# Altium schematic sheet Scrap Schematics - new UVOV protection.SchDoc
size A1
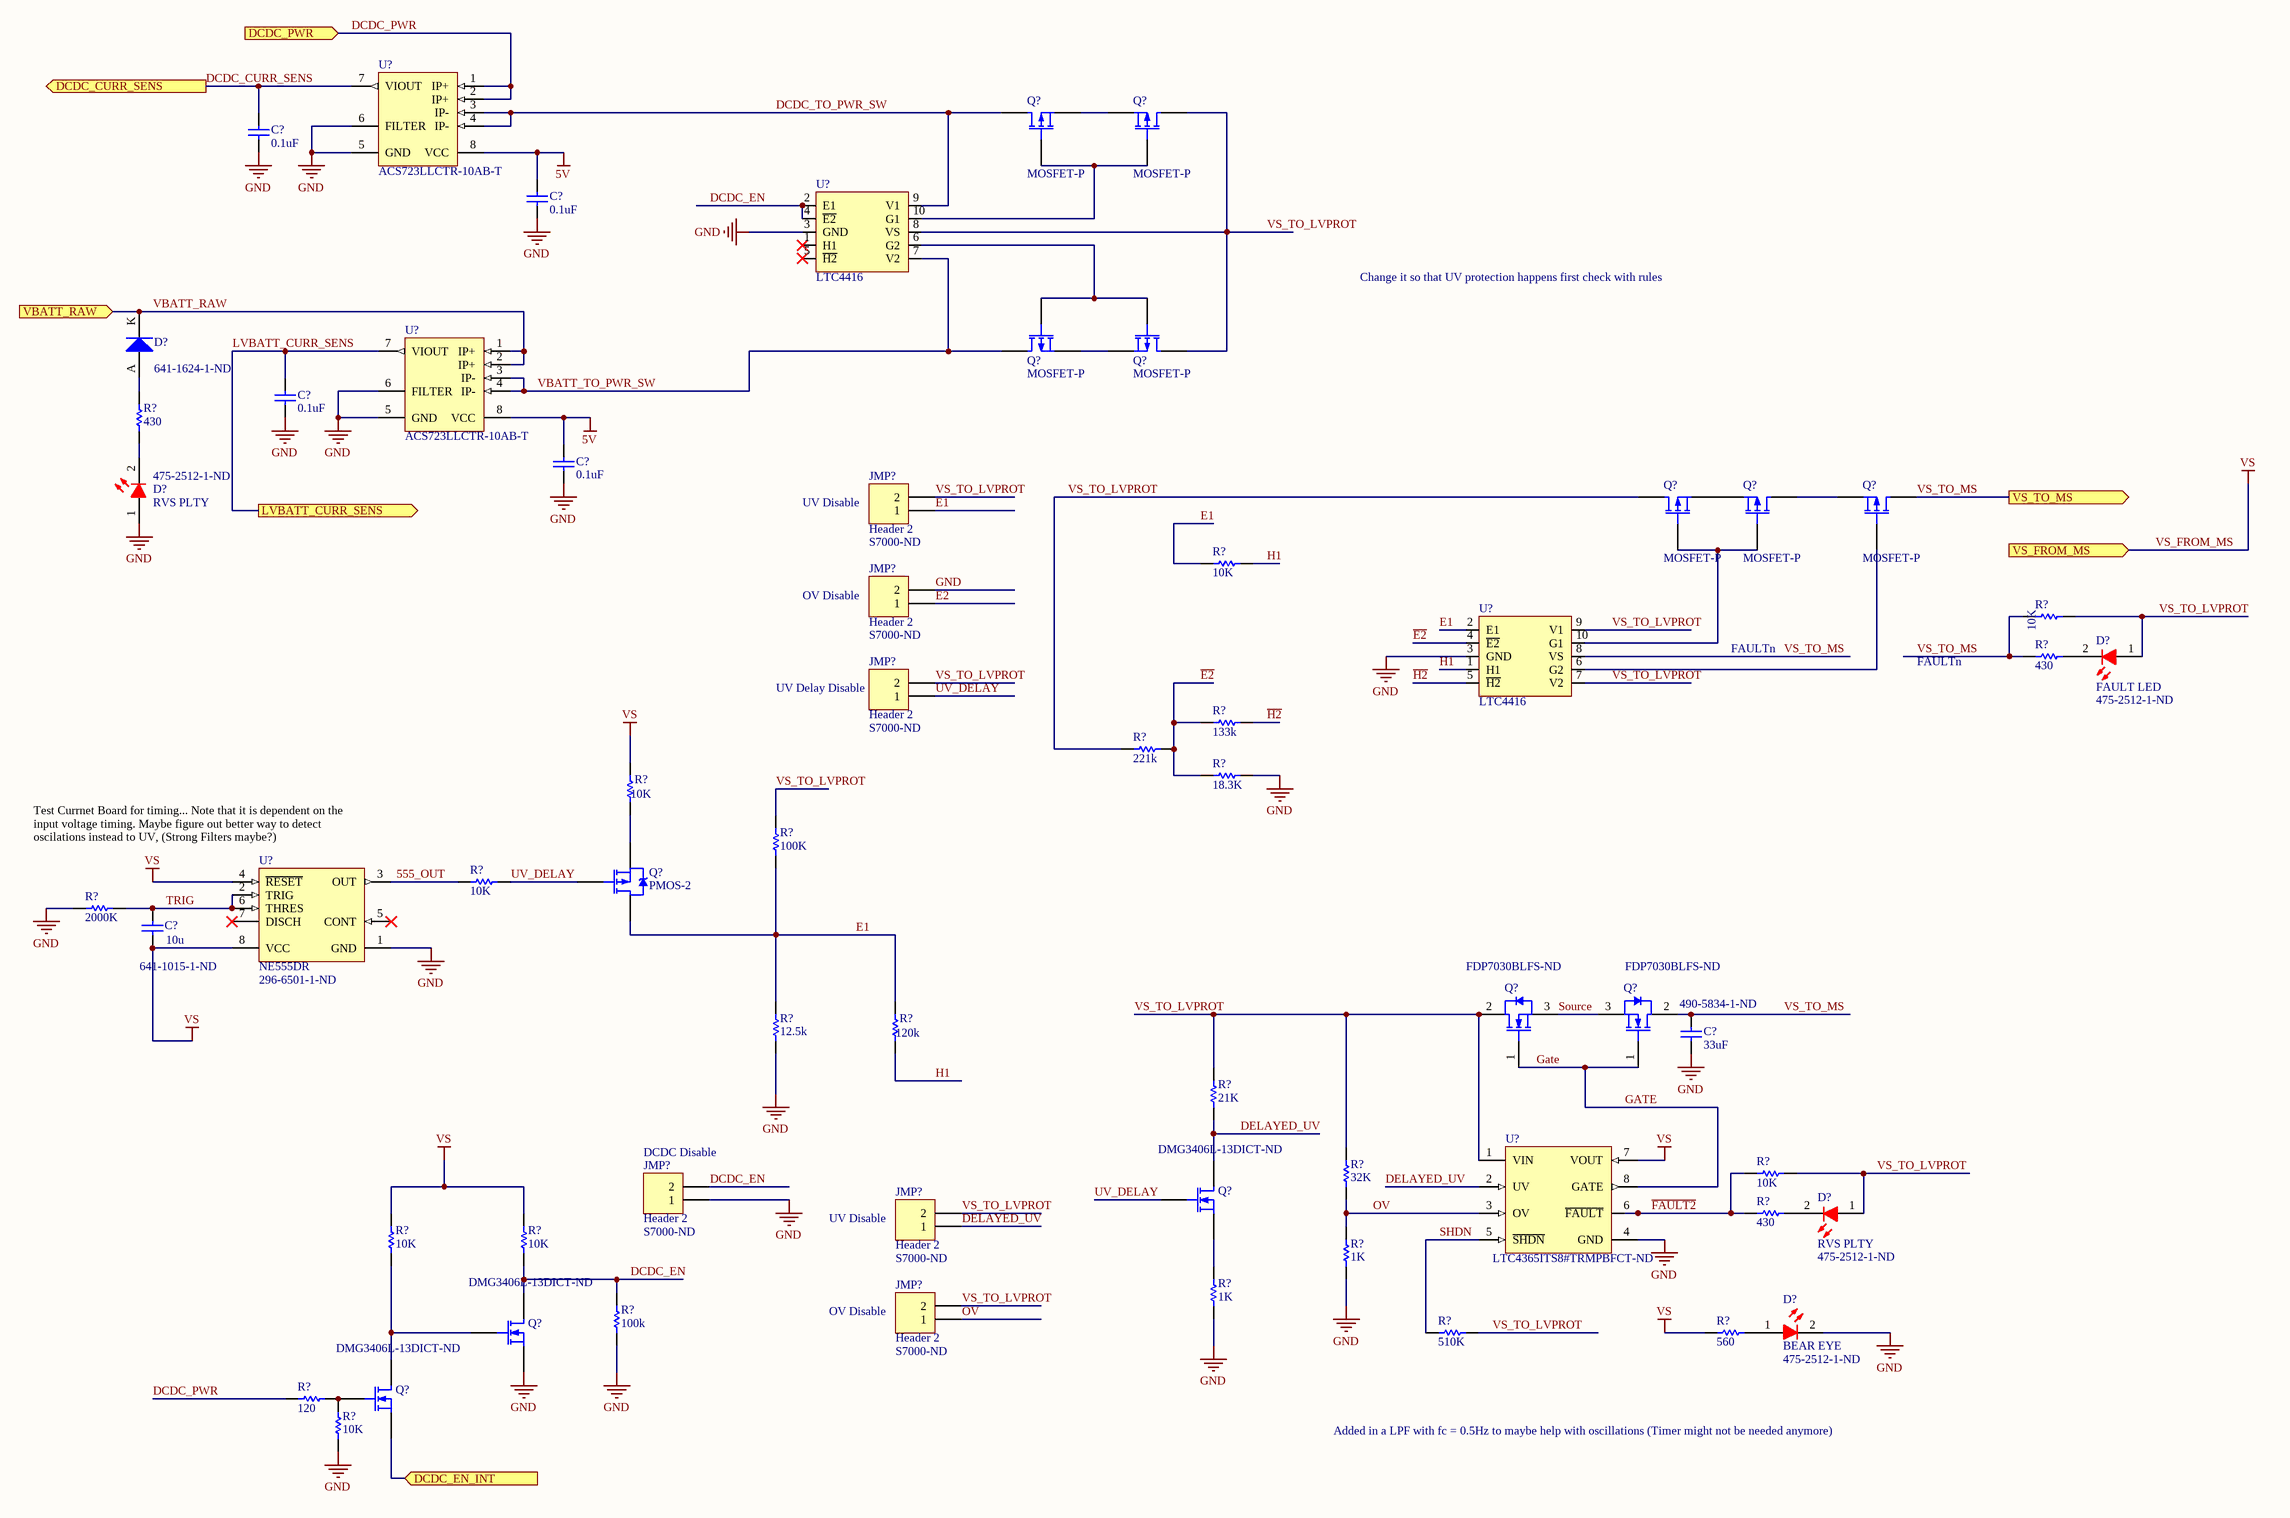
[diagram p0: Scrap Schematics - new UVOV protection.SchDoc]

## Parts
(Parts that share a designator on the sheet are numbered #1, #2 ... from top to bottom, then left to right.)
C?#1  value 0.1uF  [1608[0603]]  (hidden comment: Cap Semi)
C?#2  value 0.1uF  [1608[0603]]  (hidden comment: Cap Semi)
C?#3  value 0.1uF  [1608[0603]]  (hidden comment: Cap Semi)
C?#4  value 0.1uF  [1608[0603]]  (hidden comment: Cap Semi)
C?#5  10u  Supplier Part Number 1: 641-1015-1-ND  [C1210]
C?#6  value 33uF  Supplier Part Number 1: 490-5834-1-ND  [2J-Lead 6.1 x 5.3]  (hidden comment: Cap Semi)
D?#1  Supplier Part Number 1: 641-1624-1-ND  [SOD-123]
D?#2  RVS PLTY  Supplier Part Number 1: 475-2512-1-ND  [TOSH-0603LED_RED_V]
D?#3  FAULT LED  Supplier Part Number 1: 475-2512-1-ND  [TOSH-0603LED_RED_V]
D?#4  RVS PLTY  Supplier Part Number 1: 475-2512-1-ND  [TOSH-0603LED_RED_V]
D?#5  BEAR EYE  Supplier Part Number 1: 475-2512-1-ND  [TOSH-0603LED_RED_V]
JMP?#1  Header 2  Supplier Part Number 1: S7000-ND  [HDR1X2]
JMP?#2  Header 2  Supplier Part Number 1: S7000-ND  [HDR1X2]
JMP?#3  Header 2  Supplier Part Number 1: S7000-ND  [HDR1X2]
JMP?#4  Header 2  Supplier Part Number 1: S7000-ND  [HDR1X2]
JMP?#5  Header 2  Supplier Part Number 1: S7000-ND  [HDR1X2]
JMP?#6  Header 2  Supplier Part Number 1: S7000-ND  [HDR1X2]
Q?#1  MOSFET-P  [P-CH Mosfet]
Q?#2  MOSFET-P  [P-CH Mosfet]
Q?#3  MOSFET-P  [P-CH Mosfet]
Q?#4  MOSFET-P  [P-CH Mosfet]
Q?#5  MOSFET-P  [P-CH Mosfet]
Q?#6  MOSFET-P  [P-CH Mosfet]
Q?#7  MOSFET-P  [P-CH Mosfet]
Q?#8  PMOS-2  [SOT23_M]
Q?#9  Supplier Part Number 1: FDP7030BLFS-ND  [TO220V-GDS]
Q?#10  Supplier Part Number 1: FDP7030BLFS-ND  [TO220V-GDS]
Q?#11  Supplier Part Number 1: DMG3406L-13DICT-ND  [SOT-23_N]
Q?#12  Supplier Part Number 1: DMG3406L-13DICT-ND  [SOT-23_N]
Q?#13  Supplier Part Number 1: DMG3406L-13DICT-ND  [SOT-23_N]
R?#1  430  [RESC0603(1608)_L]
R?#2  10K  [RESC0603(1608)_L]
R?#3  10K  [RESC0603(1608)_L]
R?#4  430  [RESC0603(1608)_L]
R?#5  133k  [RESC0603(1608)_L]
R?#6  221k  [RESC0603(1608)_L]
R?#7  18.3K  [RESC0603(1608)_L]
R?#8  10K  [RESC0603(1608)_L]
R?#9  100K  [RESC0603(1608)_L]
R?#10  10K  [RESC0603(1608)_L]
R?#11  2000K  [RESC0603(1608)_L]
R?#12  120k  [RESC0603(1608)_L]
R?#13  12.5k  [RESC0603(1608)_L]
R?#14  21K  [RESC0603(1608)_L]
R?#15  32K  [RESC0603(1608)_L]
R?#16  10K  [RESC0603(1608)_L]
R?#17  430  [RESC0603(1608)_L]
R?#18  10K  [1608[0603]]
R?#19  10K  [1608[0603]]
R?#20  1K  [RESC0603(1608)_L]
R?#21  1K  [RESC0603(1608)_L]
R?#22  560  [RESC0603(1608)_L]
R?#23  100k  [1608[0603]]
R?#24  510K  [RESC0603(1608)_L]
R?#25  120  [1608[0603]]
R?#26  10K  [1608[0603]]
U?#1  ACS723LLCTR-10AB-T  [ALEG-LC-8_V]
U?#2  LTC4416  [LTC4416]
U?#3  ACS723LLCTR-10AB-T  [ALEG-LC-8_V]
U?#4  LTC4416  [LTC4416]
U?#5  NE555DR  Supplier Part Number 1: 296-6501-1-ND  [D0008A_M]
U?#6  Supplier Part Number 1: LTC4365ITS8#TRMPBFCT-ND  [LT-TS8-8-TSOT-23_V]  (hidden comment: LTC4365ITS8#TRMPBF)

## Ports
DCDC_CURR_SENS (out), DCDC_EN_INT (in), DCDC_PWR (in), LVBATT_CURR_SENS (out), VBATT_RAW (in), VS_FROM_MS (in), VS_TO_MS (out)

## Nets
5V: C?#2.2 C?#4.2 U?#1.8(VCC) U?#3.8(VCC)
GND: C?#1.1 C?#2.1 C?#3.1 C?#4.1 C?#6.2 D?#2.1(A) D?#5.2(K) JMP?#2.2 JMP?#4.1 Q?#12.2(S) R?#7.2 R?#11.2 R?#13.1 R?#20.1 R?#21.2 R?#23.1 R?#26.1 U?#1.5(GND) U?#1.6(FILTER) U?#2.3(GND) U?#3.5(GND) U?#3.6(FILTER) U?#4.3(GND) U?#5.1(GND) U?#6.4(GND)
VS_FROM_MS: C?#5.2 R?#8.1 R?#18.2 R?#19.2 R?#22.1 U?#5.4(~{RESET}) U?#5.8(VCC) U?#6.7(VOUT) ; port VS_FROM_MS  [also labelled VS]
555_OUT: R?#10.1 U?#5.3(OUT)
DCDC_CURR_SENS: C?#1.2 U?#1.7(VIOUT) ; port DCDC_CURR_SENS
DCDC_EN: JMP?#4.2 Q?#12.3(D) R?#19.1 R?#23.2 U?#2.2(E1) U?#2.4(~{E2})
DCDC_EN_INT: Q?#13.2(S) ; port DCDC_EN_INT
DCDC_PWR: R?#25.1 U?#1.1(IP+) U?#1.2(IP+) ; port DCDC_PWR
DCDC_TO_PWR_SW: Q?#1.2(D) U?#1.3(IP-) U?#1.4(IP-) U?#2.9(V1)
DELAYED_UV: JMP?#5.1 Q?#11.3(D) R?#14.2 U?#6.2(UV)
E1: JMP?#1.1 Q?#8.2(D) R?#2.1 R?#9.1 R?#12.1 R?#13.2 U?#4.2(E1)
~{E2}: JMP?#2.1 R?#5.1 R?#6.2 R?#7.1 U?#4.4(~{E2})
~{FAULT2}: R?#16.2 R?#17.1 U?#6.6(~{FAULT})
GATE: Q?#9.1(G) Q?#10.1(G) U?#6.8(GATE)
H1: R?#2.2 R?#12.2 U?#4.1(H1)
~{H2}: R?#5.2 U?#4.5(~{H2})
LVBATT_CURR_SENS: C?#3.2 U?#3.7(VIOUT) ; port LVBATT_CURR_SENS
OV: JMP?#6.1 R?#15.1 R?#20.2 U?#6.3(OV)
SHDN: R?#24.2 U?#6.5(~{SHDN})
Source: Q?#9.3(S) Q?#10.3(S)
TRIG: C?#5.1 R?#11.1 U?#5.2(TRIG) U?#5.6(THRES)
UV_DELAY: JMP?#3.1 Q?#8.1(G) Q?#11.1(G) R?#10.2
VBATT_RAW: D?#1.K U?#3.1(IP+) U?#3.2(IP+) ; port VBATT_RAW
VBATT_TO_PWR_SW: Q?#3.2(D) U?#2.7(V2) U?#3.3(IP-) U?#3.4(IP-)
VS_TO_LVPROT: D?#3.1(A) D?#4.1(A) JMP?#1.2 JMP?#3.2 JMP?#5.2 JMP?#6.2 Q?#2.2(D) Q?#4.2(D) Q?#5.2(D) Q?#9.2(D) R?#3.1 R?#6.1 R?#9.2 R?#14.1 R?#15.2 R?#16.1 R?#24.1 U?#2.8(VS) U?#4.7(V2) U?#4.9(V1) U?#6.1(VIN)
VS_TO_MS: C?#6.1 Q?#7.2(D) Q?#10.2(D) R?#3.2 R?#4.1 U?#4.8(VS) ; port VS_TO_MS
NetD?#1_A: D?#1.A R?#1.2
NetD?#2_2: D?#2.2(K) R?#1.1
NetD?#3_2: D?#3.2(K) R?#4.2
NetD?#4_2: D?#4.2(K) R?#17.2
NetD?#5_1: D?#5.1(A) R?#22.2
NetQ?#1_1: Q?#1.1(G) Q?#2.1(G) U?#2.10(G1)
NetQ?#1_3: Q?#1.3(S) Q?#2.3(S)
NetQ?#3_1: Q?#3.1(G) Q?#4.1(G) U?#2.6(G2)
NetQ?#3_3: Q?#3.3(S) Q?#4.3(S)
NetQ?#5_1: Q?#5.1(G) Q?#6.1(G) U?#4.10(G1)
NetQ?#5_3: Q?#5.3(S) Q?#6.3(S)
NetQ?#6_2: Q?#6.2(D) Q?#7.3(S)
NetQ?#7_1: Q?#7.1(G) U?#4.6(G2)
NetQ?#8_3: Q?#8.3(S) R?#8.2
NetQ?#11_2: Q?#11.2(S) R?#21.1
NetQ?#12_1: Q?#12.1(G) Q?#13.3(D) R?#18.1
NetQ?#13_1: Q?#13.1(G) R?#25.2 R?#26.2

Not connected (* = marked no-connect by the designer): U?#2 1(H1)* 5(~{H2})*; U?#5 5(CONT)* 7(DISCH)*

## Notes on the sheet
- Change it so that UV protection happens first check with rules
- (near JMP?#1) UV Disable
- (near JMP?#2) OV Disable
- FAULTn
- (near JMP?#3) UV Delay Disable
- (near U?#5) Test Currnet Board for timing... Note that it is dependent on the input voltage timing. Maybe figure out better way to detect oscilations instead to UV, (Strong Filters maybe?)
- (near JMP?#4) DCDC Disable
- (near JMP?#5) UV Disable
- (near JMP?#6) OV Disable
- Added in a LPF with fc = 0.5Hz to maybe help with oscillations (Timer might not be needed anymore)

## Library data of the parts
C?#1-C?#4 C?#6 = Cap Semi: Capacitor (Semiconductor SIM Model); Published: 8-Jun-2000; LatestRevisionDate: 29-May-2009; LatestRevisionNote: IPC-7351 Footprint Added.; PackageReference: C1206; Publisher: Altium Limited; PackageDescription: Chip Capacitor; Supplier 1: Digi-Key
  C?#1-C?#4: Supplier 2: Digi-Key; Supplier Part Number 2: 490-14359-1-ND
C?#5 = Cap: CAP CER 100UF 6.3V X5R 1206; Manufacturer: Murata Electronics North America; Manufacturer Part Number: GRM31CR60J107ME39K; Capacitance: 100µF; Tolerance: ±20%; RoHS: RoHS Compliant; Category: Capacitors; Packaging: Cut Tape (CT); Part Status: Active; Voltage - Rated: 6.3V; Temperature Coefficient: X5R; Operating Temperature: -55°C ~ 85°C; Features: -; Ratings: -; Applications: General Purpose; Mounting Type: Surface Mount, MLCC; Package / Case: 1206 (3216 Metric); Size / Dimension: 0.126" L x 0.063" W (3.20mm x 1.60mm); Height - Seated (Max): -; Thickness (Max): 0.071" (1.80mm); Lead Spacing: -; Lead Style: -; ComponentLink1URL: http://www.murata.com/~/media/webrenewal/support/library/catalog/products/capacitor/mlcc/c02e.ashx; ComponentLink1Description: http://www.murata.com/~/media/webrenewal/support/library/catalog/products/capacitor/mlcc/c02e.ashx; Supplier 1: Digi-Key
D?#1 = Diode 1N4003: 1 Amp General Purpose Rectifier; Published: 8-Jun-2000; LatestRevisionDate: 17-Jul-2002; LatestRevisionNote: Re-released for DXP Platform.; DatasheetVersion: 1998; PackageVersion: Aug-1999; PackageReference: DO-41; Publisher: Altium Limited; PackageDescription: Diode, Axial; Body 5.2 x 2.7 mm (LxDia. max), Lead Dia. 0.86 mm (max); Code_JEDEC: DO-204-AL; ComponentLink1Description: Manufacturer Link; ComponentLink1URL: http://www.fairchildsemi.com/; ComponentLink2Description: Datasheet; ComponentLink2URL: http://www.fairchildsemi.com/ds/1N%2F1N4001.pdf; Supplier 1: Digi-Key
D?#2-D?#5 = CMP-0444-00001-1: LED, Red 0603 (1608) 63mCd; Manufacturer: Toshiba; PartNumber: TLSU1008A(T04); Forward Current: 25 mA; Power Dissipation: 60 mW; Packing Type: Reel; Reverse Voltage: 4 V; Mounting Technology: Surface Mount; PackageDescription: 2-Pin SMT LED, 1.6 x 0.8 mm Pitch; ComponentLink1URL: http://www.toshiba-components.com/; ComponentLink1Description: Manufacturer URL; PackageReference: 0603LED_RED; ComponentLink2URL: http://www.semicon.toshiba.co.jp/info/docget.jsp?type=datasheet&lang=en&pid=TLSU1008A(T04); ComponentLink2Description: Datasheet; DatasheetVersion: Aug-08; Storage Temperature: -40 to 100 degC; Supplier 1: Digi-Key
JMP?#1-JMP?#6 = Header 2: Header, 2-Pin; Manufacturer: Harwin Inc.; Manufacturer Part Number: M20-9990246; Connector Type: Header, Cuttable; Pitch - Mating: 0.100" (2.54mm); Style: Board to Board or Cable; Shrouding: Unshrouded; Number of Positions: 2; Number of Positions Loaded: All; Contact Length - Mating: 0.240" (6.10mm); Contact Length - Post: 0.118" (3.00mm); Overall Contact Length: 0.460" (11.68mm); Material Flammability Rating: UL94 V-0; Current Rating: 3A per Contact; Mated Stacking Heights: 10.04mm, 10.64mm, 11.04mm, 16.54mm; LatestRevisionDate: 17-Jul-2002; LatestRevisionNote: Re-released for DXP Platform.; Publisher: Altium Limited; RoHS: RoHS Compliant; Category: Connectors, Interconnects; Packaging: Bulk; Part Status: Active; Contact Type: Male Pin; Number of Rows: 1; Row Spacing - Mating: -; Mounting Type: Through Hole; Termination: Solder; Fastening Type: Push-Pull; Insulation Height: 0.100" (2.54mm); Contact Shape: Square; Contact Finish - Mating: Tin; Contact Finish Thickness - Mating: -; Contact Finish - Post: Tin; Contact Material: Brass; Insulation Material: Polyamide (PA6T), Nylon 6T; Features: -; Operating Temperature: -40°C ~ 105°C; Ingress Protection: -; Insulation Color: Black; Voltage Rating: -; Contact Finish Thickness - Post: -; Applications: -; ComponentLink1URL: https://cdn.harwin.com/pdfs/M20-999.pdf; ComponentLink1Description: https://cdn.harwin.com/pdfs/M20-999.pdf; Supplier 1: Digi-Key
Q?#1-Q?#7 = MOSFET-P: P-Channel MOSFET  2SJ661-DL-1E; Published: 8-Jun-2000; LatestRevisionDate: 17-Jul-2002; LatestRevisionNote: Re-released for DXP Platform.; PackageVersion: 1995/1996; PackageReference: E3; Publisher: Altium Limited; PackageDescription: TO, Flat Index; 3 In-Line, Axial Leads; Body Dia. 4.6mm; Lead Dia. 0.5 mm (max)
Q?#8 = PMOS-2: MOSFET P-CH 50V 130MA SOT323; Manufacturer: Diodes Incorporated; Manufacturer Part Number: BSS84W-7-F; FET Type: P-Channel; Current - Continuous Drain (Id) @ 25°C: 130mA (Ta); Drive Voltage (Max Rds On,  Min Rds On): 5V; Vgs(th) (Max) @ Id: 2V @ 1mA; Input Capacitance (Ciss) (Max) @ Vds: 45pF @ 25V; Vgs (Max): ±20V; Power Dissipation (Max): 200mW (Ta); Rds On (Max) @ Id, Vgs: 10 Ohm @ 100mA, 5V; Supplier 1: Digi-Key; Supplier Part Number 1: BSS84W-FDICT-ND; RoHS: RoHS Compliant; Category: Discrete Semiconductor Products; Stock 1: 56690; Pricing 1: 1=0.58, 10=0.43, 100=0.2435, 500=0.16122, 1000=0.1236 (CAD); Packaging: Cut Tape (CT); Part Status: Active; Technology: MOSFET (Metal Oxide); Drain to Source Voltage (Vdss): 50V; Gate Charge (Qg) (Max) @ Vgs: -; FET Feature: -; Operating Temperature: -55°C ~ 150°C (TJ); Mounting Type: Surface Mount; Supplier Device Package: SOT-323; Package / Case: SC-70, SOT-323; ComponentLink1URL: http://www.diodes.com/assets/Datasheets/ds30205.pdf; ComponentLink1Description: http://www.diodes.com/assets/Datasheets/ds30205.pdf
Q?#9 Q?#10 = CMP-1058-00860-1: Power MOSFET, 40 V, 167 A, Single N-Channel, 3-Pin TO-220, Pb-Free, Tube; Qrr Typ (nC): 140; Channel Polarity: N Channel; Crss Typ (pF): 450; Ciss Typ (pF): 4300; Coss Typ (pF): 1075; ID Max (A): 167; PackageDescription: 3-Pin Flange Mount, Vertical Straight Lead, Body 9.97 x 4.445 mm, Pitch 2.54 mm; Configuration: Single; PackageVersion: Rev. AG, 09/2011; RoHS: Pb-Free; PackageReference: TO-220-3-221A-09; Package Type: TO-220-3; DatasheetVersion: Rev. 7; Packing: Tube; Mounting Technology: Through Hole; Supplier 1: Digi-Key
Q?#11-Q?#13 = MOSFET-N: N-Channel MOSFET; Manufacturer: Infineon Technologies; Manufacturer Part Number: IPD075N03L G; FET Type: MOSFET N-Channel, Metal Oxide; FET Feature: Logic Level Gate; Drain to Source Voltage (Vdss): 30V; Current - Continuous Drain (Id) @ 25°C: 50A (Tc); Rds On (Max) @ Id, Vgs: 7.5 mOhm @ 30A, 10V; Vgs(th) (Max) @ Id: 2.2V @ 250µA; Gate Charge (Qg) @ Vgs: 18nC @ 10V; Input Capacitance (Ciss) @ Vds: 1900pF @ 15V; Power - Max: 47W; Published: 8-Jun-2000; LatestRevisionDate: 17-Jul-2002; LatestRevisionNote: Re-released for DXP Platform.; PackageVersion: 1995/1996; PackageReference: E3; Publisher: Altium Limited; PackageDescription: TO, Flat Index; 3 In-Line, Axial Leads; Body Dia. 4.6mm; Lead Dia. 0.5 mm (max); RoHS: RoHS Compliant; Category: Discrete Semiconductor Products; Packaging: Cut Tape (CT); Mounting Type: Surface Mount; Package / Case: TO-252-3, DPak (2 Leads + Tab), SC-63; Supplier Device Package: PG-TO252-3; ComponentLink1URL: http://www.infineon.com/dgdl/Infineon-IPD075N03LG-DS-v02_01-en.pdf?folderId=5546d4694909da4801490a07012f053b&fileId=db3a30431936bc4b011951d824f83aeb; ComponentLink1Description: http://www.infineon.com/dgdl/Infineon-IPD075N03LG-DS-v02_01-en.pdf?folderId=5546d4694909da4801490a07012f053b&fileId=db3a30431936bc4b011951d824f83aeb; ComponentLink2URL: http://www.semicon.toshiba.co.jp/info/docget.jsp?type=datasheet&lang=en&pid=SSM3K329R; ComponentLink2Description: http://www.semicon.toshiba.co.jp/info/docget.jsp?type=datasheet&lang=en&pid=SSM3K329R; Supplier 1: Digi-Key
R?#1-R?#17 R?#20-R?#22 R?#24 = CMP-1591-00001-1: 0603 (1608 Metric) Chip Resistor; Case-Metric: 1608; Case-EIA: 0603; PackageReference: RESC0603(1608)
  R?#1 R?#4 R?#17: Supplier 1: Digi-Key; Supplier Part Number 1: P430BZCT-ND
  R?#2 R?#3 R?#5-R?#10 R?#12 R?#13 R?#16: Supplier 1: Digi-Key; Supplier Part Number 1: 311-10KGRCT-ND
  R?#11 R?#15 R?#20: Supplier 1: Digi-Key
  R?#22: Supplier 1: Digi-Key; Supplier Part Number 1: P560BZCT-ND
R?#18 R?#19 R?#26 = Res1: Resistor; Manufacturer: Rohm Semiconductor; Manufacturer Part Number: ESR03EZPJ103; Tolerance: ±5%; Power (Watts): 0.25W, 1/4W; Temperature Coefficient: ±200ppm/°C; Published: 8-Jun-2000; LatestRevisionDate: 17-Jul-2002; LatestRevisionNote: Re-released for DXP Platform.; PackageReference: AXIAL-0.3; Publisher: Altium Limited; PackageDescription: Axial Device, Thru-Hole; 2 Leads; 0.3 in Pin Spacing; Value: 10K; Supplier 1: Digi-Key; Supplier Part Number 1: RHM10KDCT-ND; RoHS: RoHS Compliant; Category: Resistors; Stock 1: 8360; Pricing 1: 1=0.15, 10=0.121, 25=0.0836, 100=0.0466, 250=0.03628, 500=0.02884, 1000=0.02046 (CAD); Packaging: Cut Tape (CT); Resistance (Ohms): 10k; Composition: Thick Film; Features: Automotive AEC-Q200, Pulse Withstanding; Operating Temperature: -55°C ~ 155°C; Package / Case: 0603 (1608 Metric); Supplier Device Package: 0603 (1608 Metric); Size / Dimension: 0.063" L x 0.031" W (1.60mm x 0.80mm); Height: 0.022" (0.55mm); Number of Terminations: 2; ComponentLink1URL: http://rohmfs.rohm.com/en/products/databook/datasheet/passive/resistor/chip_resistor/esr.pdf; ComponentLink1Description: http://rohmfs.rohm.com/en/products/databook/datasheet/passive/resistor/chip_resistor/esr.pdf
R?#23 = Res1: Resistor; Manufacturer: Rohm Semiconductor; Manufacturer Part Number: ESR03EZPJ103; Value: 10K; Tolerance: ±5%; Power (Watts): 0.25W, 1/4W; Temperature Coefficient: ±200ppm/°C; Published: 8-Jun-2000; LatestRevisionDate: 17-Jul-2002; LatestRevisionNote: Re-released for DXP Platform.; PackageReference: AXIAL-0.3; Publisher: Altium Limited; PackageDescription: Axial Device, Thru-Hole; 2 Leads; 0.3 in Pin Spacing; Supplier 1: Digi-Key; Supplier Part Number 1: RHM10KDCT-ND; RoHS: RoHS Compliant; Category: Resistors; Stock 1: 8360; Pricing 1: 1=0.15, 10=0.121, 25=0.0836, 100=0.0466, 250=0.03628, 500=0.02884, 1000=0.02046 (CAD); Packaging: Cut Tape (CT); Resistance (Ohms): 10k; Composition: Thick Film; Features: Automotive AEC-Q200, Pulse Withstanding; Operating Temperature: -55°C ~ 155°C; Package / Case: 0603 (1608 Metric); Supplier Device Package: 0603 (1608 Metric); Size / Dimension: 0.063" L x 0.031" W (1.60mm x 0.80mm); Height: 0.022" (0.55mm); Number of Terminations: 2; ComponentLink1URL: http://rohmfs.rohm.com/en/products/databook/datasheet/passive/resistor/chip_resistor/esr.pdf; ComponentLink1Description: http://rohmfs.rohm.com/en/products/databook/datasheet/passive/resistor/chip_resistor/esr.pdf
R?#25 = Res1: Resistor; Manufacturer: Panasonic Electronic Components; Manufacturer Part Number: ERJ-3EKF60R4V; Resistance (Ohms): 60.4; Tolerance: ±1%; Power (Watts): 0.1W, 1/10W; Temperature Coefficient: ±100ppm/°C; Published: 8-Jun-2000; LatestRevisionDate: 17-Jul-2002; LatestRevisionNote: Re-released for DXP Platform.; PackageReference: AXIAL-0.3; Publisher: Altium Limited; PackageDescription: Axial Device, Thru-Hole; 2 Leads; 0.3 in Pin Spacing; Value: 120; Supplier 1: Digi-Key; Supplier Part Number 1: P60.4HCT-ND; RoHS: RoHS Compliant; Category: Resistors; Stock 1: 113077; Pricing 1: 1=0.15, 50=0.0176, 100=0.0129, 250=0.00992, 500=0.0079, 1000=0.00583 (CAD); Packaging: Cut Tape (CT); Composition: Thick Film; Features: Automotive AEC-Q200; Operating Temperature: -55°C ~ 155°C; Package / Case: 0603 (1608 Metric); Supplier Device Package: 0603; Size / Dimension: 0.063" L x 0.031" W (1.60mm x 0.80mm); Height: 0.022" (0.55mm); Number of Terminations: 2; ComponentLink1URL: http://industrial.panasonic.com/www-cgi/jvcr13pz.cgi?E+PZ+3+AOA0002+ERJ3EKF60R4V+7+WW; ComponentLink1Description: http://industrial.panasonic.com/www-cgi/jvcr13pz.cgi?E+PZ+3+AOA0002+ERJ3EKF60R4V+7+WW
U?#1 U?#3 = CMP-0826-00001-1: Linear Current Sensor IC, 4.5 to 5.5 V Supply Voltage, 10 mA Supply Current, -40 to 85 degC, 8-Pin SOIC (LC), RoHS, Tape and Reel; Manufacturer: Allegro Microsystems; PartNumber: ACS712ELCTR-20A-T; CLOAD: 10 nF Max.; ICC: 10 mA; F: 80 kHz; RLOAD: 4.7 kOhm Min.; Optimized Accuracy Range: +/- 20 A; TR: 3.5 us; Sensitivity Sens: 100 mV/A Typ.; Operating Temperature Range: -40 to 85 degC; ComponentLink2URL: http://www.allegromicro.com/~/media/Files/Datasheets/ACS712-Datasheet.ashx; ComponentLink1Description: Manufacturer URL; VCC: 4.5 to 5.5 V; Mounting Technology: Surface Mount; DatasheetVersion: Rev. 15; ComponentLink2Description: Datasheet; ComponentLink1URL: http://www.allegromicro.com/; PackageDescription: 8-Pin SOIC, Body 4.9 x 3.9 mm, Pitch 1.27 mm; PackageReference: LC-8; RoHS: TRUE; Packing: Tape and Reel; Supplier 1: Digi-Key; Supplier Part Number 1: 620-1190-1-ND
U?#2 U?#4 = LTC4416: IC Dual Comparator
U?#5 = CMP-1685-00007-1: Precision Timer, 4.5 to 16 V, 0 to 70 degC, 8-Pin SOIC (D8), Green (RoHS & no Sb/Br), Tape and Reel; Forward Voltage: 450 mV; Forward Current: 1 A; Max Surge Current: 30 A; Peak Reverse Current: 500 uA; Case\Package: SMA; PackageReference: D0008A; Width: 2.84 mm; PackageDescription: 8-Pin Small Outline Integrated Circuit, Body 4.9 x 3.9 mm, Pitch 1.27 mm; DatasheetVersion: SLFS022I, 09/2014; ComponentLink2Description: Datasheet; Package Quantity: 1; REACH SVHC: Unknown; Radiation Hardening: No; Height: 2.44 mm; Code_JEDEC: MS-012; Pins: 2; ComponentLink1Description: Manufacturer URL; ComponentLink3Description: Package Specification; ComponentLink3URL: http://www.ti.com/lit/ml/msoi002j/msoi002j.pdf; Length: 4.57 mm; ComponentLink1URL: http://www.ti.com/; Mount: Surface Mount; PackageVersion: 4040047-3/M, 06/2011; ComponentLink2URL: http://www.ti.com/general/docs/lit/getliterature.tsp?genericPartNumber=NE555&fileType=pdf; RoHSCompliant: true; Max Operating Temperature: 125 degC; Packaging: Cut Tape; Min Operating Temperature: -55 degC; Supplier 1: Digi-Key
U?#6 = CMP-0474-00861-1: UV, OV and Reverse Supply Protection Controller, 2.5 to 34 V Vin, 8-pin SOT23 (TS8-8), -40 to 85 degC, Pb-Free, Mini Tape and Reel; Manufacturer: Linear Technology; Fault: yes; Fast Comparator: no; Extended Temp: C, I, H; Circuit Breakers(#): 1; RoHS: TRUE; ComponentLink2URL: http://cds.linear.com/docs/en/datasheet/4365f.pdf; PartNumber: LTC4365ITS8#TRMPBF; ComponentLink3Description: Package Specification; Power Good: no; Packing: Mini Tape and Reel; ComponentLink2Description: Datasheet; Vin Range: 2.5 to 34 V; Active Limiting: no; Foldback: no; Reset: no; ComponentLink3URL: http://cds.linear.com/docs/en/packaging/SOT_8_05-08-1637.pdf; PackageVersion: Rev. A, 08/2010; Code_JEDEC: MO-193; ComponentLink1Description: Manufacturer URL; Mounting Technology: Surface Mount; ComponentLink1URL: http://www.linear.com/; PackageDescription: 8-Pin Plastic TSOT-23, Body 2.9 x 1.63 mm, Pitch 0.65 mm; PackageReference: TS8-8; Supplier 1: Digi-Key